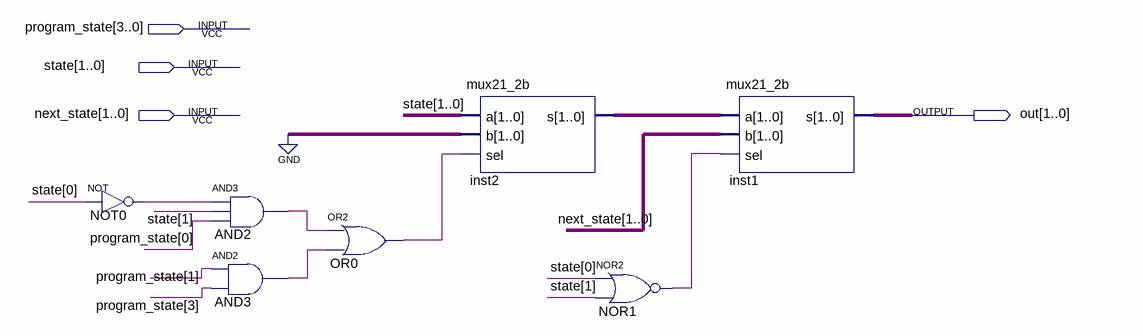
[diagram p0: schematic sheet]
// Quartus schematic program_state.bdf as structural Verilog: 7 symbols, 4 pins
module program_state (
  input  [3:0] program_state,
  input  [1:0] state,
  input  [1:0] next_state,
  output [1:0] out
);

  wire AND2_out, AND3_out, NOR1_out, NOT0_out, OR0_out;
  wire [1:0] inst2_s;

  not NOT0 (NOT0_out, state[0]);
  and AND2 (AND2_out, NOT0_out, state[1], program_state[0]);
  and AND3 (AND3_out, program_state[1], program_state[3]);
  or OR0 (OR0_out, AND2_out, AND3_out);
  mux21_2b inst2 (.a(state), .b(2'b00), .sel(OR0_out), .s(inst2_s));
  nor NOR1 (NOR1_out, state[0], state[1]);
  mux21_2b inst1 (.a(inst2_s), .b(next_state), .sel(NOR1_out), .s(out));
endmodule
